# EasyEDA Pro project PicoLED.epro

# Schematic Schematic1
Board Name: Board1; Create Date: 2025-03-28; Page Name: P1; Project Name: pico-led; Schematic Name: Schematic1; Update Date: 2025-05-20; Company: EasyEDA.com; Page Size: A4; Version: V1.0
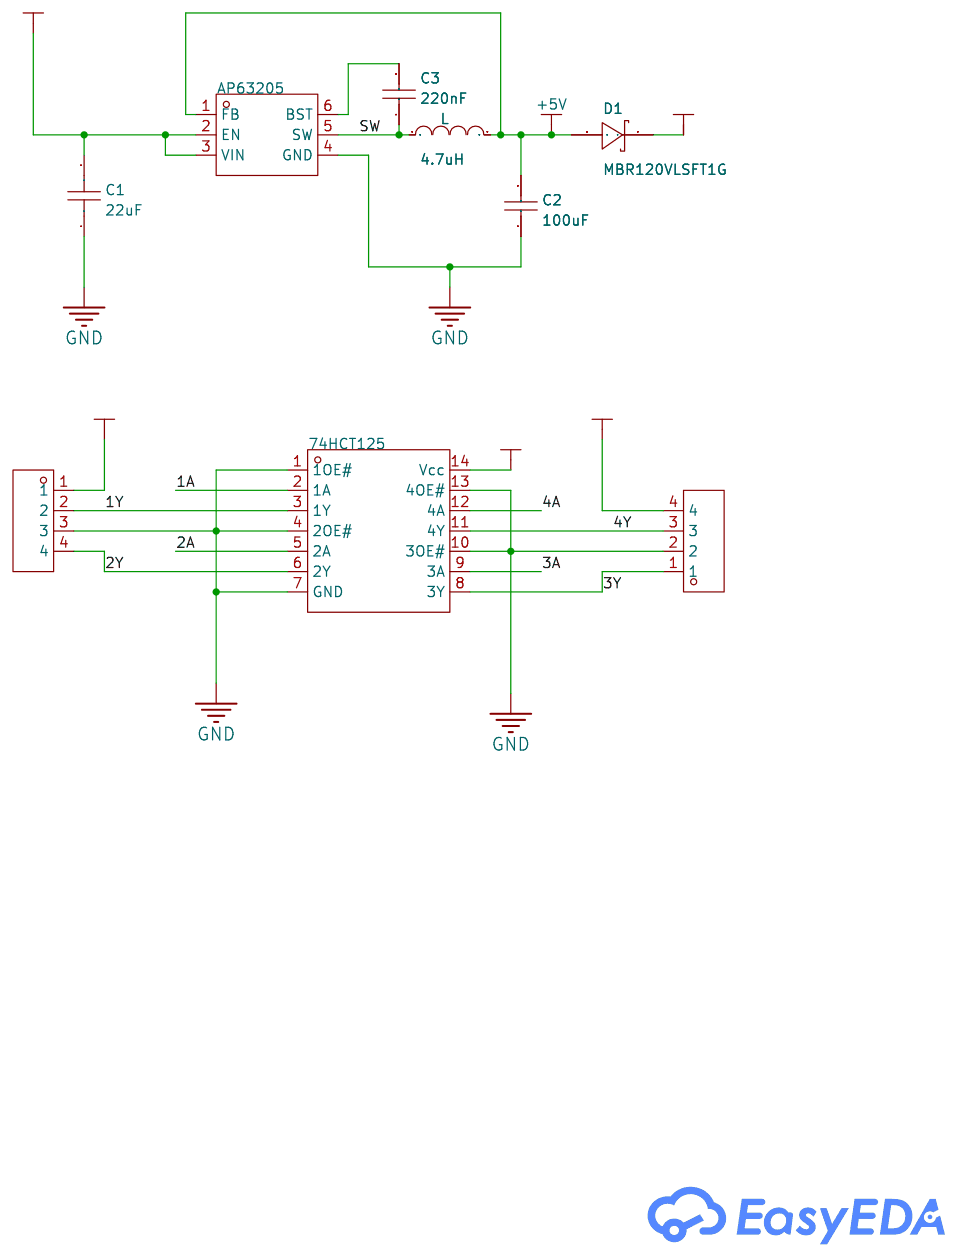
[diagram p0: schematic sheet]

## Parts
74HCT125  74HCT125T14-13  [TSSOP-14_L5.0-W4.4-P0.65-LS6.4-BL]
AP63205  AP63205WU-7  [TSOT-23-6_L2.9-W1.6-P0.95-LS2.8-BL]
C1  22uF  [C1210]
C2  100uF  [C1210]
C3  220nF  [C0603]
CN1  DB125-3.5-4P-GN-S  [CONN-TH_DB125-3.5-4P-GN]
CN2  DB125-3.5-4P-GN-S  [CONN-TH_DB125-3.5-4P-GN]
D1  MBR120VLSFT1G  [SOD-123F_L2.8-W1.8-LS3.7-RD]
L  4.7uH  [IND-SMD_L4.0-W4.0]

## Library data of the parts
74HCT125 = 74HCT125T14-13: output type:Tri-State Supply Voltage:4.5V~5.5V Supply Voltage:4.5V~5.5V Number of Elements:4 Number of Bits per Element:1 Sink Current:4mA Source Current:4mA Logic Family:74HCT Operating Temperature:-40℃~+125℃ Operating Temperature:-40℃~+125℃; Supplier Part: C842453; Manufacturer: DIODES(美台); Supplier Footprint: TSSOP-14; JLCPCB Part Class: Extended Part; Datasheet: https://atta.szlcsc.com/upload/public/pdf/source/20210611/C842453_44966D70497D36F042B3AD5F171A07CB.pdf; Supplier: LCSC; output type: Tri-State; Supply Voltage: 4.5V~5.5V; Number of Elements: 4; Number of Bits per Element: 1; Sink Current: 4mA; Source Current: 4mA; Logic Family: 74HCT; Operating Temperature: -40℃~+125℃
AP63205 = AP63205WU-7: Function:Step-down type Output Type:Fixed Input Voltage:3.8V~32V Input Voltage:3.8V~32V Output Voltage:5V Output Voltage:5V Output Current:2A Switching Frequency:1100kHz Switching Frequency:1100kHz Operating Temperature:-40℃~+85℃@(TA) Operating Temperatur; LCSC Part Name: 3.8V至32V输入、2A低静态电流同步降压转换器，增强EMI抑制; Supplier Part: C2071056; Manufacturer: DIODES(美台); Supplier Footprint: TSOT-23-6; JLCPCB Part Class: Extended Part; Datasheet: https://atta.szlcsc.com/upload/public/pdf/source/20210622/C780769_099C67289BD3EC61AAFB52D8B07125B3.pdf; Supplier: LCSC; Function: Step-down type; Output Type: Fixed; Input Voltage: 3.8V~32V; Output Voltage: 5V; Output Current: 2A; Switching Frequency: 1100kHz; Operating Temperature: -40℃~+85℃@(TA); Synchronous Rectification: Yes; Number of Outputs: 1; Topology: Step-down; Quiescent Current (Iq): 22uA; Switch tube (built-in/external): Built-in
C1 = GMK325BJ226MM-P: Capacitance: Tolerance:±20% Tolerance:±20% Voltage Rated: Temperature Coefficient:; LCSC Part Name: 22uF ±20% 35V; Supplier Part: C778721; Manufacturer: TAIYO YUDEN(太诱); Supplier Footprint: 1210; JLCPCB Part Class: Extended Part; Datasheet: https://atta.szlcsc.com/upload/public/pdf/source/20200107/C471398_4D150C2F82D9DF0CFE325EE548591887.pdf; Supplier: LCSC; Tolerance: ±20%
C2 = CL32A107MQVNNNE: Capacitance: Tolerance:±20% Tolerance:±20% Voltage Rated: Temperature Coefficient:; LCSC Part Name: 100uF ±20% 6.3V; Supplier Part: C49066; Manufacturer: SAMSUNG(三星); Supplier Footprint: 1210; JLCPCB Part Class: Extended Part; Datasheet: https://atta.szlcsc.com/upload/public/pdf/source/20160218/1457707763339.pdf; Supplier: LCSC; Tolerance: ±20%
C3 = CL10B224KB8NNNC: Capacitance: Tolerance:±10% Tolerance:±10% Voltage Rated: Temperature Coefficient:; LCSC Part Name: 220nF ±10% 50V; Supplier Part: C64705; Manufacturer: SAMSUNG(三星); Supplier Footprint: 0603; JLCPCB Part Class: Extended Part; Datasheet: https://atta.szlcsc.com/upload/public/pdf/source/20160218/1457707763339.pdf; Supplier: LCSC; Tolerance: ±10%
CN1 CN2 = DB125-3.5-4P-GN-S: Structure:1x4P Pitch:3.5mm Color:Green Mounting Style:Straight Current Rating (Max):13.5A Voltage Rating (Max):250V Number of Pins:4P Number of Rows:1 Wire Gauge - AWG:16~28 Wire Gauge - AWG:16~28 Wire Gauge - mm2:1 Wire Gauge - mm2:1 Number of PINs Per R; LCSC Part Name: 3.5mm 1x4P 排数:1 每排P数:4 直插; Supplier Part: C2757925; Manufacturer: DORABO(地博电气); Supplier Footprint: 插件,P=3.5mm; JLCPCB Part Class: Extended Part; Datasheet: https://atta.szlcsc.com/upload/public/pdf/source/20221227/3B943AA1CFCAE24F1BA4E72404938A89.pdf; Supplier: LCSC; Structure: 1x4P; Pitch: 3.5mm; Color: Green; Mounting Style: Straight; Current Rating (Max): 13.5A; Voltage Rating (Max): 250V; Number of Pins: 4P; Number of Rows: 1; Wire Gauge - AWG: 16~28; Wire Gauge - mm2: 1; Number of PINs Per Row: 4; Operating Temperature Range: -40℃~+105℃
D1 = MBR120VLSFT1G: Forward Voltage (Vf@If):300mV@1A Reverse Voltage (Vr):20V Average Rectified Current (Io):1A Reverse Leakage Current (Ir):600uA@20V; LCSC Part Name: 电压:20V 电流:1A; Supplier Part: C223608; Manufacturer: onsemi(安森美); Supplier Footprint: SOD-123FL; JLCPCB Part Class: Extended Part; Datasheet: https://atta.szlcsc.com/upload/public/pdf/source/20221020/29D26ECD33A75D76A8E47ED9553F3BCF.pdf; Supplier: LCSC; Forward Voltage (Vf@If): 300mV@1A; Reverse Voltage (Vr): 20V; Average Rectified Current (Io): 1A; Reverse Leakage Current (Ir): 600uA@20V
L = CR4030-4R7M: Inductance: Tolerance:±20% Tolerance:±20% Rated Current: Saturation Current (Isat):2.9A DC Resistance (DCR):; LCSC Part Name: 4.7uH ±20% 2.9A; Supplier Part: C520319; Manufacturer: ceaiya(柯爱亚); Supplier Footprint: SMD,4x4mm; JLCPCB Part Class: Extended Part; Datasheet: https://atta.szlcsc.com/upload/public/pdf/source/20200424/C520276_8639ABF18B4A41322D74F24464FD005B.pdf; Supplier: LCSC; Tolerance: ±20%; Saturation Current (Isat): 2.9A

## Nets
+5V: AP63205.1(FB) C2.2 D1.2(A) L.2
GND: 74HCT125.1(1OE#) 74HCT125.4(2OE#) 74HCT125.7(GND) 74HCT125.10(3OE#) 74HCT125.13(4OE#) AP63205.4(GND) C1.1 C2.1 CN1.3 CN2.2
VIN: AP63205.2(EN) AP63205.3(VIN) C1.2 CN1.1 CN2.4
1A: 74HCT125.2(1A)
1Y: 74HCT125.3(1Y) CN1.2
2A: 74HCT125.5(2A)
2Y: 74HCT125.6(2Y) CN1.4
3A: 74HCT125.9(3A)
3Y: 74HCT125.8(3Y) CN2.1
4A: 74HCT125.12(4A)
4Y: 74HCT125.11(4Y) CN2.3
SW: AP63205.5(SW) C3.1 L.1
VSYS: 74HCT125.14(Vcc) D1.1(K)
$1N476: AP63205.6(BST) C3.2

# Board PCB1
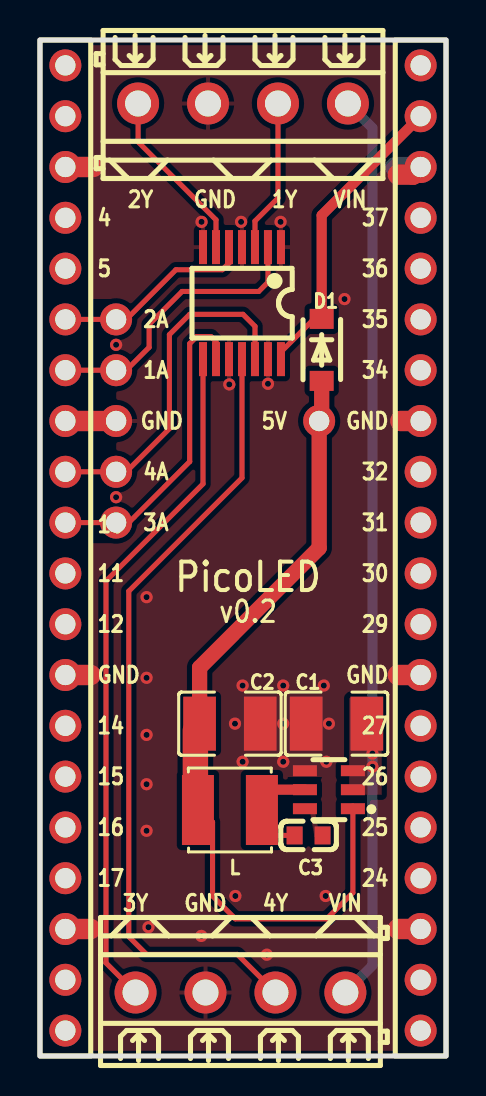
[diagram p1: board, top side]
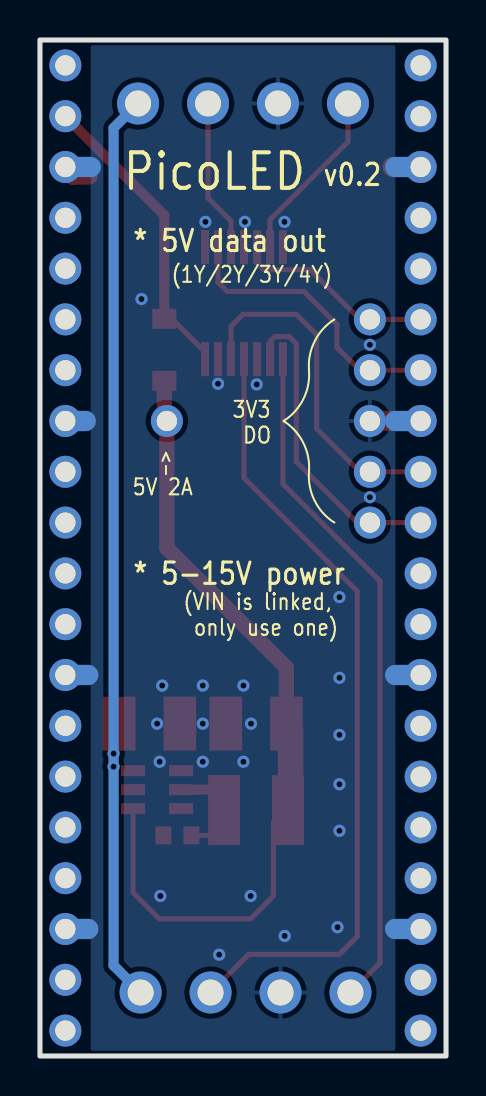
[diagram p2: board, bottom side, seen from below]

Outline 20.32 x 50.8 mm; copper layers: Top Layer, Bottom Layer. Coordinates in mm from the lower left corner of the outline.
Outline path: rectangle 0,50.8 20.32,0
Stack: Top Layer 0.035mm / Dielectric1 1.51mm FR4 er 4.5 / Bottom Layer 0.035mm

## Design rules (mm)
template: JLCPCB Capability(Two Layers Board)
spacing copperThickness1oz (default): track to track 0.102, other pairs 0.152 to 0.3
spacing copperThickness2oz: track to track 0.203, other pairs 0.152 to 0.3
track width copperThickness1oz (default): min 0.127, default 0.254, max 2.54
track width copperThickness2oz: min 0.203, default 0.254, max 2.54
differential pair differentialPair (default): width min 0.127, default 0.254, max 2.54; gap min 0.152, default 0.152
via viaSize (default): diameter min 0.5, default 0.61, max 10; hole min 0.3, default 0.305, max 6.3

## Placement (name value [footprint] x y rotation side)
74HCT125  74HCT125T14-13  [TSSOP-14_L5.0-W4.4-P0.65-LS6.4-BL]  10.11 37.64 180 top
AP63205  AP63205WU-7  [TSOT-23-6_L2.9-W1.6-P0.95-LS2.8-BL]  14.46 13.32 90 top
C1  22uF  [C1210]  14.84 16.62 0 top
C2  100uF  [C1210]  9.51 16.62 180 top
C3  220nF  [C0603]  13.44 11.03 0 top
CN1  DB125-3.5-4P-GN-S  [CONN-TH_DB125-3.5-4P-GN]  10.16 47.63 180 top
CN2  DB125-3.5-4P-GN-S  [CONN-TH_DB125-3.5-4P-GN]  10.03 3.18 0 top
D1  MBR120VLSFT1G  [SOD-123F_L2.8-W1.8-LS3.7-RD]  14.1 35.31 270 top
L  4.7uH  [IND-SMD_L4.0-W4.0]  9.51 12.3 180 top
NOREF  -  [Pad_e52]  1.27 13.97 0 top
NOREF#2  -  [Pad_e31]  1.27 36.83 0 top
NOREF#3  -  [Pad_e58]  19.05 24.13 0 top
NOREF#4  -  [Pad_e41]  19.05 41.91 0 top
NOREF#5  -  [Pad_e59]  19.05 8.89 0 top
NOREF#6  -  [Pad_e24]  1.27 46.99 0 top
NOREF#7  -  [Pad_e62]  19.05 1.27 0 top
NOREF#8  -  [Pad_e60]  19.05 6.35 0 top
NOREF#9  -  [Pad_e1056]  3.81 26.67 0 top
NOREF#10  -  [Pad_e55]  1.27 3.81 0 top
NOREF#11  -  [Pad_e3124]  13.97 31.75 0 top
NOREF#12  -  [Pad_e38]  19.05 49.53 0 top
NOREF#13  -  [Pad_e57]  1.27 8.89 0 top
NOREF#14  -  [Pad_e43]  19.05 36.83 0 top
NOREF#15  -  [Pad_e9]  1.27 49.53 0 top
NOREF#16  -  [Pad_e30]  1.27 39.37 0 top
NOREF#17  -  [Pad_e33]  1.27 31.75 0 top
NOREF#18  -  [Pad_e49]  1.27 21.59 0 top
NOREF#19  -  [Pad_e1052]  3.81 34.29 0 top
NOREF#20  -  [Pad_e46]  19.05 31.75 0 top
NOREF#21  -  [Pad_e65]  19.05 16.51 0 top
NOREF#22  -  [Pad_e66]  19.05 19.05 0 top
NOREF#23  -  [Pad_e63]  19.05 11.43 0 top
NOREF#24  -  [Pad_e40]  19.05 44.45 0 top
NOREF#25  -  [Pad_e34]  1.27 29.21 0 top
NOREF#26  -  [Pad_e1054]  3.81 36.83 0 top
NOREF#27  -  [Pad_e32]  1.27 34.29 0 top
NOREF#28  -  [Pad_e47]  19.05 34.29 0 top
NOREF#29  -  [Pad_e44]  19.05 26.67 0 top
NOREF#30  -  [Pad_e1057]  3.81 31.75 0 top
NOREF#31  -  [Pad_e56]  1.27 6.35 0 top
NOREF#32  -  [Pad_e67]  19.05 21.59 0 top
NOREF#33  -  [Pad_e1055]  3.81 29.21 0 top
NOREF#34  -  [Pad_e54]  1.27 1.27 0 top
NOREF#35  -  [Pad_e35]  1.27 26.67 0 top
NOREF#36  -  [Pad_e42]  19.05 39.37 0 top
NOREF#37  -  [Pad_e64]  19.05 13.97 0 top
NOREF#38  -  [Pad_e61]  19.05 3.81 0 top
NOREF#39  -  [Pad_e48]  1.27 24.13 0 top
NOREF#40  -  [Pad_e29]  1.27 41.91 0 top
NOREF#41  -  [Pad_e39]  19.05 46.99 0 top
NOREF#42  -  [Pad_e50]  1.27 19.05 0 top
NOREF#43  -  [Pad_e45]  19.05 29.21 0 top
NOREF#44  -  [Pad_e51]  1.27 16.51 0 top
NOREF#45  -  [Pad_e53]  1.27 11.43 0 top
NOREF#46  -  [Pad_e25]  1.27 44.45 0 top

## Footprints (pads in the part's own frame, mm; a bottom-side part is the same pattern mirrored in y, then rotated)
C0603
  rect 0.8x0.9 smd: 1(-0.7,0) 2(0.7,0)
C1210
  rect 1.635x2.7 smd: 1(-1.518,0) 2(1.518,0)
CONN-TH_DB125-3.5-4P-GN
  round 2.1 hole 1.3: 1(-5.25,0) 2(-1.75,0) 3(1.75,0) 4(5.25,0)
IND-SMD_L4.0-W4.0
  rect 1.6x3.5 smd: 1(-1.6,0) 2(1.6,0)
Pad_e9
  round 1.6 hole 1.016: 1(0,0)
Pad_e24
  round 1.6 hole 1.016: 2(0,0)
Pad_e25
  round 1.6 hole 1.016: 3(0,0)
Pad_e29
  round 1.6 hole 1.016: 4(0,0)
Pad_e30
  round 1.6 hole 1.016: 5(0,0)
Pad_e31
  round 1.6 hole 1.016: 6(0,0)
Pad_e32
  round 1.6 hole 1.016: 7(0,0)
Pad_e33
  round 1.6 hole 1.016: 8(0,0)
Pad_e34
  round 1.6 hole 1.016: 9(0,0)
Pad_e35
  round 1.6 hole 1.016: 10(0,0)
Pad_e38
  round 1.6 hole 1.016: 40(0,0)
Pad_e39
  round 1.6 hole 1.016: 39(0,0)
Pad_e40
  round 1.6 hole 1.016: 38(0,0)
Pad_e41
  round 1.6 hole 1.016: 37(0,0)
Pad_e42
  round 1.6 hole 1.016: 36(0,0)
Pad_e43
  round 1.6 hole 1.016: 35(0,0)
Pad_e44
  round 1.6 hole 1.016: 31(0,0)
Pad_e45
  round 1.6 hole 1.016: 32(0,0)
Pad_e46
  round 1.6 hole 1.016: 33(0,0)
Pad_e47
  round 1.6 hole 1.016: 34(0,0)
Pad_e48
  round 1.6 hole 1.016: 11(0,0)
Pad_e49
  round 1.6 hole 1.016: 12(0,0)
Pad_e50
  round 1.6 hole 1.016: 13(0,0)
Pad_e51
  round 1.6 hole 1.016: 14(0,0)
Pad_e52
  round 1.6 hole 1.016: 15(0,0)
Pad_e53
  round 1.6 hole 1.016: 16(0,0)
Pad_e54
  round 1.6 hole 1.016: 20(0,0)
Pad_e55
  round 1.6 hole 1.016: 19(0,0)
Pad_e56
  round 1.6 hole 1.016: 18(0,0)
Pad_e57
  round 1.6 hole 1.016: 17(0,0)
Pad_e58
  round 1.6 hole 1.016: 30(0,0)
Pad_e59
  round 1.6 hole 1.016: 24(0,0)
Pad_e60
  round 1.6 hole 1.016: 23(0,0)
Pad_e61
  round 1.6 hole 1.016: 21(0,0)
Pad_e62
  round 1.6 hole 1.016: 20(0,0)
Pad_e63
  round 1.6 hole 1.016: 25(0,0)
Pad_e64
  round 1.6 hole 1.016: 26(0,0)
Pad_e65
  round 1.6 hole 1.016: 27(0,0)
Pad_e66
  round 1.6 hole 1.016: 28(0,0)
Pad_e67
  round 1.6 hole 1.016: 29(0,0)
Pad_e1052
  round 1.6 hole 1.016: 1(0,0)
Pad_e1054
  round 1.6 hole 1.016: 1(0,0)
Pad_e1055
  round 1.6 hole 1.016: 1(0,0)
Pad_e1056
  round 1.6 hole 1.016: 1(0,0)
Pad_e1057
  round 1.6 hole 1.016: 1(0,0)
Pad_e3124
  round 1.6 hole 1.016: 5V(0,0)
SOD-123F_L2.8-W1.8-LS3.7-RD
  rect 1x1.2 smd: 1(-1.55,0) 2(1.55,0)
TSOT-23-6_L2.9-W1.6-P0.95-LS2.8-BL
  rect 0.55x1.2 smd: 1(-0.95,-1.2) 2(0,-1.2) 3(0.95,-1.2) 4(0.95,1.2) 5(0,1.2) 6(-0.95,1.2)
TSSOP-14_L5.0-W4.4-P0.65-LS6.4-BL
  rect 0.4x1.7 smd: 1(-1.95,-2.8) 2(-1.3,-2.8) 3(-0.65,-2.8) 4(0,-2.8) 5(0.65,-2.8) 6(1.3,-2.8) 7(1.95,-2.8) 8(1.95,2.8) 9(1.3,2.8) 10(0.65,2.8) 11(0,2.8) 12(-0.65,2.8) 13(-1.3,2.8) 14(-1.95,2.8)

## Nets
+5V: AP63205.1 C2.2 D1.2 L.2 NOREF#11.5V
GND: 74HCT125.1 74HCT125.4 74HCT125.7 74HCT125.10 74HCT125.13 AP63205.4 C1.1 C2.1 CN1.3 CN2.2 NOREF#8.23 NOREF#17.8 NOREF#20.33 NOREF#22.28 NOREF#24.38 NOREF#30.1 NOREF#31.18 NOREF#42.13 NOREF#46.3
VIN: AP63205.2 AP63205.3 C1.2 CN1.1 CN2.4
1A: 74HCT125.2 NOREF#19.1 NOREF#27.7
1Y: 74HCT125.3 CN1.2
2A: 74HCT125.5 NOREF#2.6 NOREF#26.1
2Y: 74HCT125.6 CN1.4
3A: 74HCT125.9 NOREF#9.1 NOREF#35.10
3Y: 74HCT125.8 CN2.1
4A: 74HCT125.12 NOREF#25.9 NOREF#33.1
4Y: 74HCT125.11 CN2.3
SW: AP63205.5 C3.1 L.1
VSYS: 74HCT125.14 D1.1 NOREF#41.39
$1N476: AP63205.6 C3.2

Pads without a net: NOREF 15; NOREF#3 30; NOREF#4 37; NOREF#5 24; NOREF#6 2; NOREF#7 20; NOREF#10 19; NOREF#12 40; NOREF#13 17; NOREF#14 35; NOREF#15 1; NOREF#16 5; NOREF#18 12; NOREF#21 27; NOREF#23 25; NOREF#28 34; NOREF#29 31; NOREF#32 29; NOREF#34 20; NOREF#36 36; NOREF#37 26; NOREF#38 21; NOREF#39 11; NOREF#40 4; NOREF#43 32; NOREF#44 14; NOREF#45 16

## Via types
v1: diameter 0.61, hole 0.305, Top Layer to Bottom Layer, 29 vias

## Routing (per net, layer and track width the routed paths; a pad name or vN(x,y) marks a point on that pad's centre or on a via; arc(x,y) is an arc through that point)
+5V: length 40.6
  Top Layer w0.254: 7.91,12.43 8.64,11.7 8.64,8 9.78,6.86 14.35,6.86 15.66,8.17 15.66,12.49
  Top Layer w0.762: 7.99,16.74 7.99,19.42 13.97,25.4 NOREF#11.5V 14.1,31.88 D1.2
  Top Layer w1.27: 7.78,12.3 7.78,16.29
GND: length 20.7
  Top Layer w1.016: NOREF#17.8 NOREF#30.1 ; NOREF#22.28 17.91,19.05 ; 17.91,44.07 18.67,44.07 NOREF#24.38 ; NOREF#8.23 17.91,6.35 ; NOREF#42.13 2.54,19.05 ; 18.03,31.75 NOREF#20.33 ; NOREF#31.18 2.54,6.35 ; NOREF#46.3 2.67,44.45
  Bottom Layer w1.016: NOREF#24.38 17.78,44.45 ; NOREF#46.3 2.54,44.45 ; NOREF#42.13 2.54,19.05 ; NOREF#31.18 2.54,6.35 ; 18.03,31.75 18.63,31.75 18.63,31.76 19.04,31.76 ; NOREF#22.28 17.91,19.05 ; NOREF#17.8 2.54,31.75 ; NOREF#8.23 17.91,6.35
  vias: v1(3.81,35.56) v1(3.81,27.94) v1(5.33,22.94) v1(5.33,18.91) v1(5.33,16.06) v1(5.33,13.59) v1(5.33,11.26) v1(5.43,6.44) v1(8.08,41.71) v1(8.07,6) v1(9.47,33.58) v1(9.76,16.62) v1(9.78,8) v1(10.06,41.71) v1(10.14,18.52) v1(10.14,14.71) v1(11.41,33.61) v1(11.35,5.07) v1(12.04,41.71) v1(12.17,18.52) v1(12.17,16.62) v1(12.17,14.71) v1(14.2,18.52) v1(14.33,14.71) v1(14.3,8) v1(14.46,16.62) v1(15.24,37.85)
VIN: length 45.5
  Bottom Layer w0.508: CN2.4 16.64,4.53 v1(16.64,14.47) v1(16.64,15.12) 16.64,46.4 CN1.1
1A: length 13.9
  Top Layer w0.254: 11.41,40.44 11.41,38.69 10.95,38.23 7.11,38.23 5.46,36.58 5.46,35.43 4.32,34.29 ; NOREF#27.7 NOREF#19.1
1Y: length 7.7
  Top Layer w0.254: 74HCT125.3 10.76,41.75 11.91,42.9 CN1.2
2A: length 9.7
  Top Layer w0.254: NOREF#2.6 NOREF#26.1 ; 4.32,36.83 6.8,39.31 9.12,39.31 9.47,39.66 9.47,40.43 74HCT125.5
2Y: length 8.8
  Top Layer w0.254: 74HCT125.6 8.81,41.81 4.91,45.71 CN1.4
3A: length 15.3
  Top Layer w0.254: NOREF#35.10 NOREF#9.1 ; 4.32,26.67 4.44,26.67 7.49,29.72 7.49,35.62 7.84,35.97 8.56,35.97 8.81,35.72 8.81,34.84
3Y: length 34.3
  Top Layer w0.254: CN2.1 3.3,4.66 3.3,23.75 8.16,28.61 8.16,34.84
4A: length 16.9
  Top Layer w0.254: 4.32,29.21 6.48,31.37 6.48,36.07 7.49,37.08 10.16,37.08 10.76,36.49 10.76,34.84 ; NOREF#25.9 NOREF#33.1
4Y: length 39.7
  Top Layer w0.254: 10.11,34.84 10.11,28.91 4.44,23.24 4.44,5.97 5.33,5.08 9.88,5.08 CN2.3
SW: length 2.6
  Top Layer w0.254: C3.1 11.61,11.03
  Top Layer w0.508: AP63205.5 11.79,13.32
VSYS: length 15.3
  Top Layer w0.254: D1.1 13.71,36.86 12.06,35.2 12.06,34.84
  Top Layer w0.508: D1.1 14.1,42.04 NOREF#41.39

## Copper pours and planes (outline as drawn; the poured copper is in the pictures)
GND on Top Layer: 2.54,0.25 17.78,0.25 17.78,50.55 2.54,50.55
GND on Top Layer: 9.38,18.44 14.71,18.44 14.71,11.92 9.38,11.92
GND on Bottom Layer: 2.54,50.55 17.78,50.55 17.78,0.25 2.54,0.25
VIN on Top Layer: 15.47,17.9 17.1,17.9 17.1,13.06 15.47,13.06

Small or netless copper shapes (teardrops, artwork), in the pictures only: 1 on Top Layer

## Text on the board
Bottom Silkscreen Layer: <- | 5V 2A | 3V3 / DO | (VIN is linked, / only use one) | (1Y/2Y/3Y/4Y) | v0.2 | * 5V data out | * 5-15V power | PicoLED
Top Silkscreen Layer: 4 | 5 | 11 | 12 | GND | 14 | 15 | 16 | 17 | 2A | 1A | 4A | 3A | 10 | 2Y | 1Y | VIN | 3Y | 4Y | 5V | 37 | 36 | 35 | 34 | 32 | 31 | 30 | 29 | 27 | 26 | 25 | 24 | v0.2 | PicoLED
